# Altium schematic sheet THIETBINHIEPTIM.SchDoc
size 431 x 279 mm; SheetNumber: 1; SheetTotal: 1
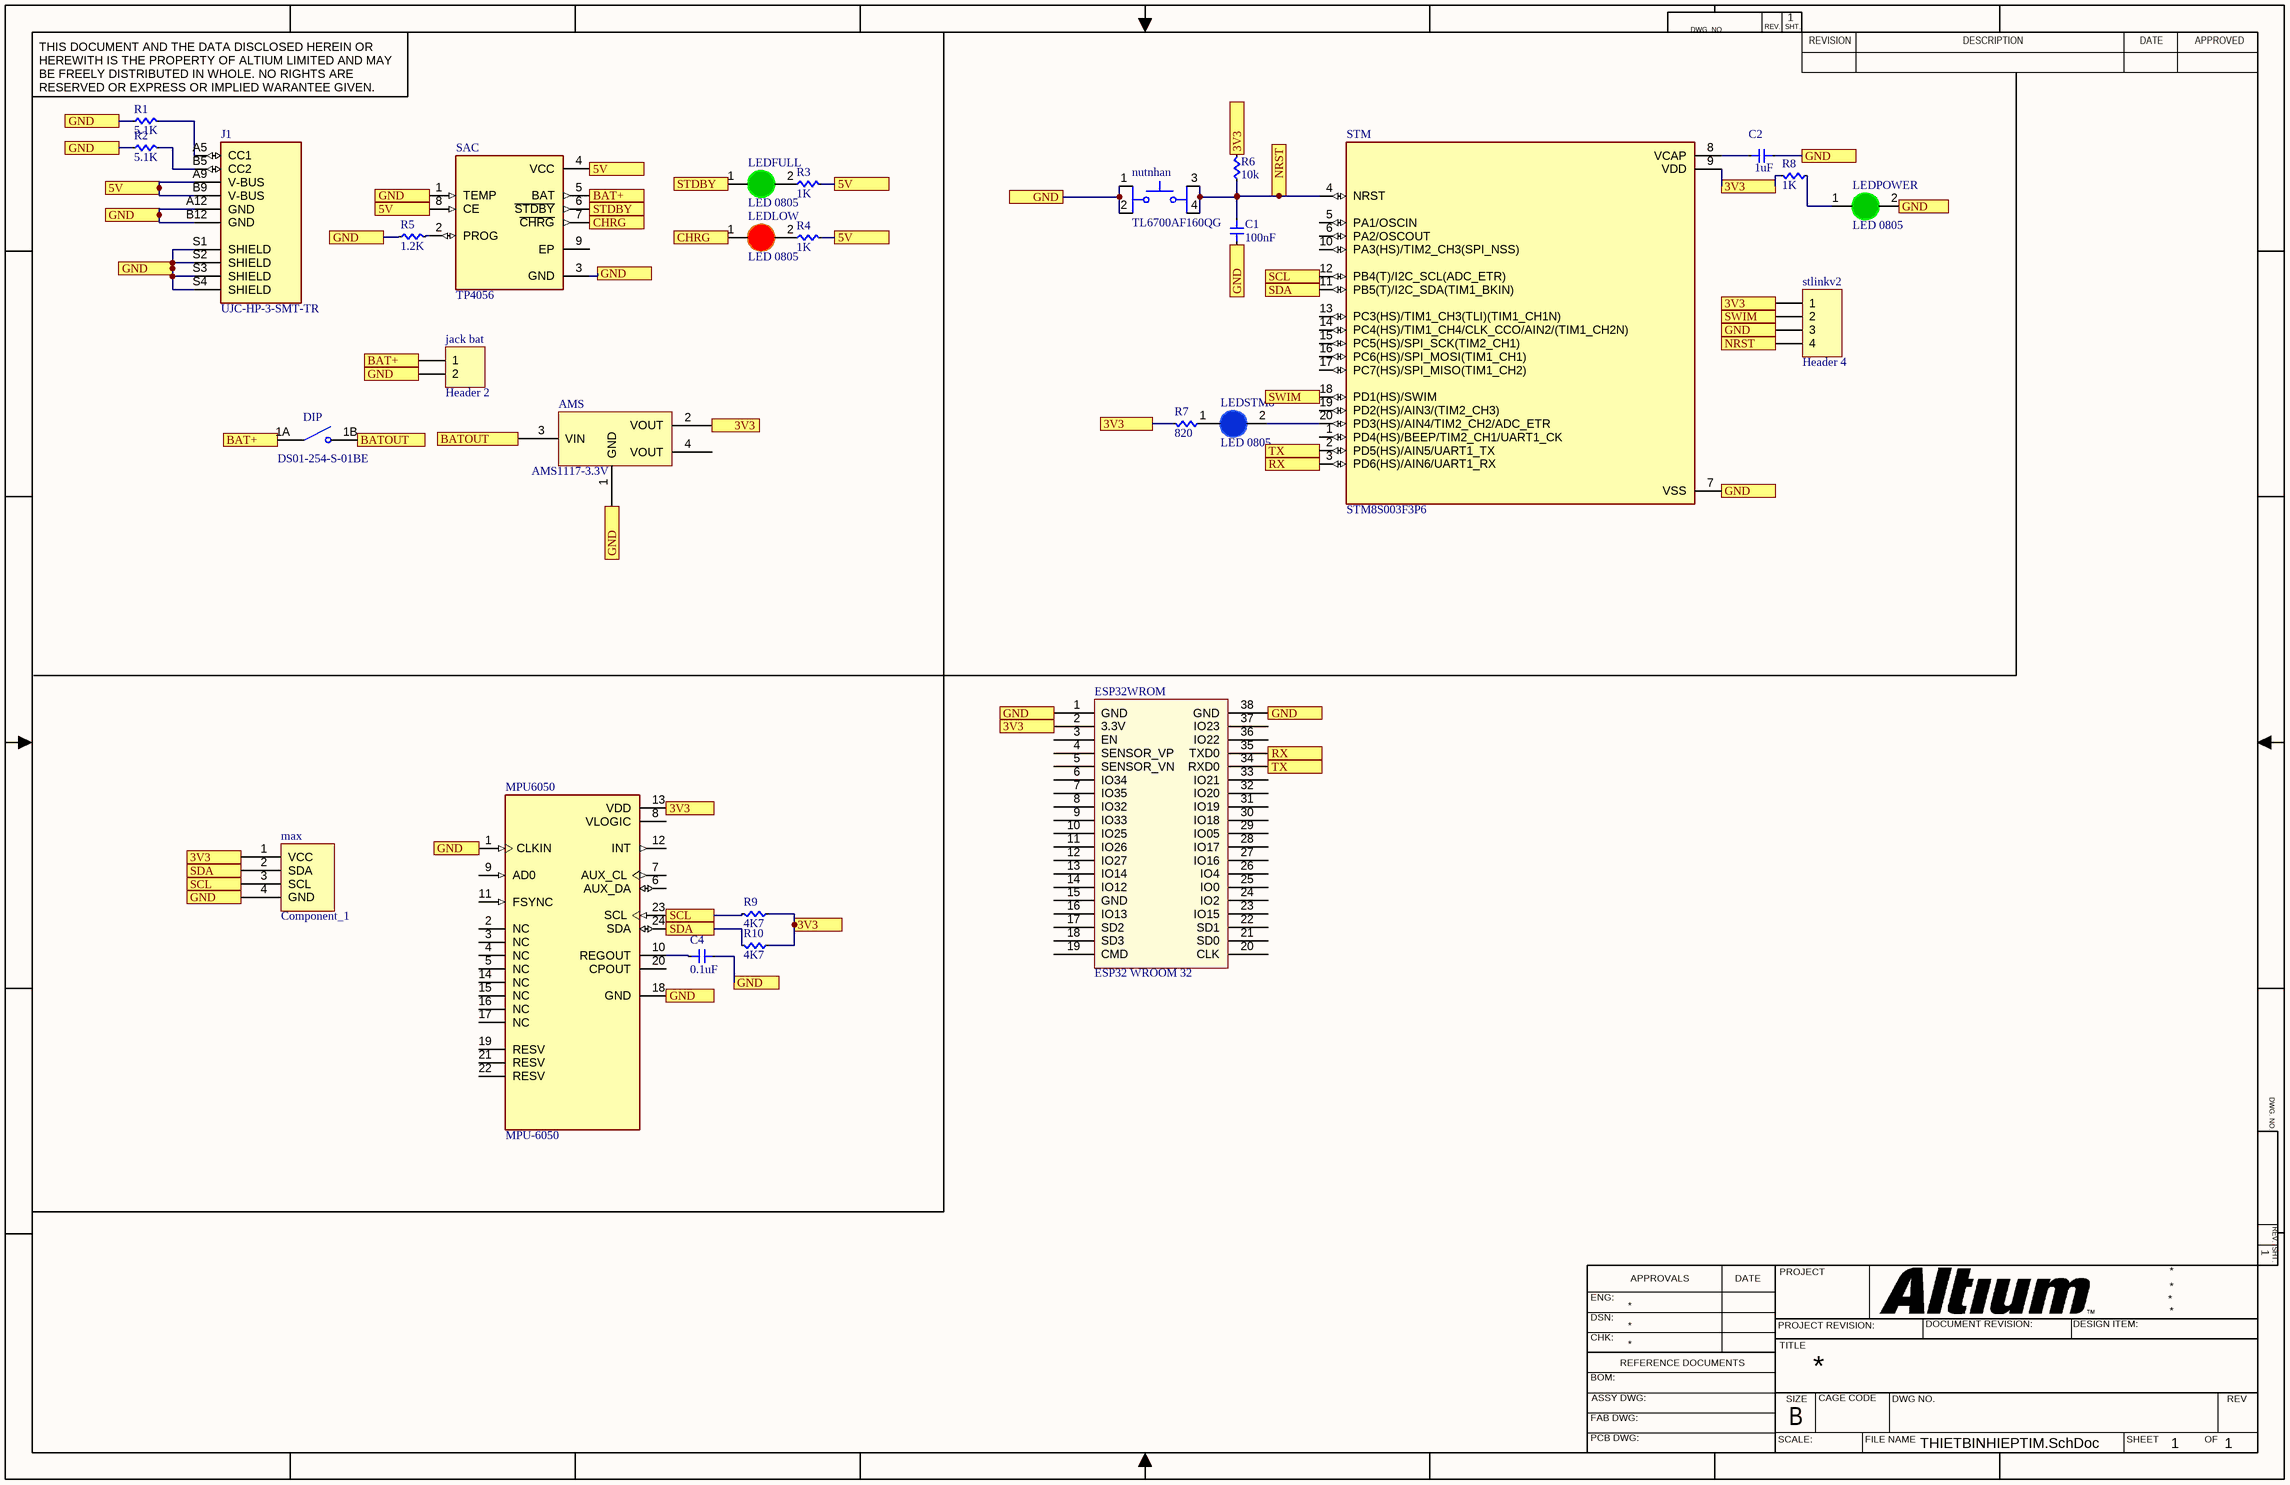
[diagram p0: THIETBINHIEPTIM.SchDoc]

## Parts
AMS  AMS1117-3.3V  [SOT223]
C1  100nF  [Cap 0201]
C2  1uF  [Cap 0201]
C4  0.1uF  [Cap 0201]
DIP  DS01-254-S-01BE  [SW_DS01-254-S-01BE]
ESP32WROM  ESP32 WROOM 32  [ESP32-WROOM-32D]
J1  UJC-HP-3-SMT-TR  [CUI_UJC-HP-3-SMT-TR]
jack_bat  Header 2  [HDR1X2]
LEDFULL  LED 0805  [LED-0805-Green]
LEDLOW  LED 0805  [LED-0805-Red]
LEDPOWER  LED 0805  [LED-0805-Green]
LEDSTM8  LED 0805  [LED-0805-Blue]
max  Component_1  [PCBComponent_1]
MPU6050  MPU-6050  [QFN50P400X400X95-24N]
nutnhan  TL6700AF160QG  [SW_TL6700AF160QG]
R1  5.1K  [RES 0402]
R2  5.1K  [RES 0402]
R3  1K  [RES 0402]
R4  1K  [RES 0402]
R5  1.2K  [RES 0402]
R6  10k  [RES 0402]
R7  820  [RES 0402]
R8  1K  [RES 0402]
R9  4K7  [RES 0402]
R10  4K7  [RES 0402]
SAC  TP4056  [SOP127P600X175-9N]
stlinkv2  Header 4  [HDR1X4]
STM  STM8S003F3P6  [SOP65P640X120-20N]

## Ports
3V3, 5V, BAT+, BATOUT, CHRG, GND, NRST, RX, SCL, SDA, STDBY, SWIM, TX

## Nets
3V3: AMS.2(VOUT) ESP32WROM.2(3.3V) max.1(VCC) MPU6050.13(VDD) R6.2 R7.2 R8.2 R9.1 R10.1 stlinkv2.1 STM.9(VDD) ; port 3V3
5V: J1.A9(V-BUS) J1.B9(V-BUS) R3.2 R4.2 SAC.4(VCC) SAC.8(CE) ; port 5V
BAT+: DIP.1A(COM1) jack_bat.1 SAC.5(BAT) ; port BAT+
BATOUT: AMS.3(VIN) DIP.1B(NO1) ; port BATOUT
CHRG: LEDLOW.1(A) SAC.7(~{CHRG}) ; port CHRG
GND: AMS.1(GND) C1.2 C2.1 C4.2 ESP32WROM.1(GND) ESP32WROM.38(GND) J1.A12(GND) J1.B12(GND) J1.S1(SHIELD) J1.S2(SHIELD) J1.S3(SHIELD) J1.S4(SHIELD) jack_bat.2 LEDPOWER.2(K) max.4(GND) MPU6050.1(CLKIN) MPU6050.18(GND) nutnhan.1 nutnhan.2 R1.1 R2.1 R5.1 SAC.1(TEMP) SAC.3(GND) stlinkv2.3 STM.7(VSS) ; port GND
NRST: C1.1 nutnhan.3 nutnhan.4 R6.1 stlinkv2.4 STM.4(NRST) ; port NRST
RX: ESP32WROM.35(TXD0) STM.3(PD6(HS)/AIN6/UART1_RX) ; port RX
SCL: max.3(SCL) MPU6050.23(SCL) R9.2 STM.12(PB4(T)/I2C_SCL(ADC_ETR)) ; port SCL
SDA: max.2(SDA) MPU6050.24(SDA) R10.2 STM.11(PB5(T)/I2C_SDA(TIM1_BKIN)) ; port SDA
STDBY: LEDFULL.1(A) SAC.6(~{STDBY}) ; port STDBY
SWIM: stlinkv2.2 STM.18(PD1(HS)/SWIM) ; port SWIM
TX: ESP32WROM.34(RXD0) STM.2(PD5(HS)/AIN5/UART1_TX) ; port TX
NetC2_2: C2.2 STM.8(VCAP)
NetC4_1: C4.1 MPU6050.10(REGOUT)
NetJ1_A5: J1.A5(CC1) R1.2
NetJ1_B5: J1.B5(CC2) R2.2
NetLEDFULL_2: LEDFULL.2(K) R3.1
NetLEDLOW_2: LEDLOW.2(K) R4.1
NetLEDPOWER_1: LEDPOWER.1(A) R8.1
NetLEDSTM8_1: LEDSTM8.1(A) R7.1
NetLEDSTM8_2: LEDSTM8.2(K) STM.20(PD3(HS)/AIN4/TIM2_CH2/ADC_ETR)
NetR5_2: R5.2 SAC.2(PROG)

Not connected (* = marked no-connect by the designer): AMS 4(VOUT); ESP32WROM 3(EN) 4(SENSOR_VP) 5(SENSOR_VN) 6(IO34) 7(IO35) 8(IO32) 9(IO33) 10(IO25) 11(IO26) 12(IO27) 13(IO14) 14(IO12) 15(GND) 16(IO13) 17(SD2) 18(SD3) 19(CMD) 20(CLK) 21(SD0) 22(SD1) 23(IO15) 24(IO2) 25(IO0) 26(IO4) 27(IO16) 28(IO17) 29(IO05) 30(IO18) 31(IO19) 32(IO20) 33(IO21) 36(IO22) 37(IO23); MPU6050 2(NC) 3(NC) 4(NC) 5(NC) 6(AUX_DA) 7(AUX_CL) 8(VLOGIC) 9(AD0) 11(FSYNC) 12(INT) 14(NC) 15(NC) 16(NC) 17(NC) 19(RESV) 20(CPOUT) 21(RESV) 22(RESV); SAC 9(EP); STM 1(PD4(HS)/BEEP/TIM2_CH1/UART1_CK) 5(PA1/OSCIN) 6(PA2/OSCOUT) 10(PA3(HS)/TIM2_CH3(SPI_NSS)) 13(PC3(HS)/TIM1_CH3(TLI)(TIM1_CH1N)) 14(PC4(HS)/TIM1_CH4/CLK_CCO/AIN2/(TIM1_CH2N)) 15(PC5(HS)/SPI_SCK(TIM2_CH1)) 16(PC6(HS)/SPI_MOSI(TIM1_CH1)) 17(PC7(HS)/SPI_MISO(TIM1_CH2)) 19(PD2(HS)/AIN3/(TIM2_CH3))

## Notes on the sheet
- DWG. NO.
- REV.
- SHT.
- THIS DOCUMENT AND THE DATA DISCLOSED HEREIN OR HEREWITH IS THE PROPERTY OF ALTIUM LIMITED AND MAY BE FREELY DISTRIBUTED IN WHOLE. NO RIGHTS ARE RESERVED OR EXPRESS OR IMPLIED WARANTEE GIVEN.
- REVISION
- DESCRIPTION
- DATE
- APPROVED
- ENG:
- APPROVALS
- PROJECT
- DSN:
- CHK:
- REFERENCE DOCUMENTS
- PROJECT REVISION:
- TITLE
- DOCUMENT REVISION:
- DESIGN ITEM:
- BOM:
- FAB DWG:
- PCB DWG:
- ASSY DWG:
- SCALE:
- SIZE
- B
- CAGE CODE
- FILE NAME
- DWG NO.
- SHEET
- OF
- REV

## Library data of the parts
AMS = AMS1117 SMD: Dán; Value: AMS1117-3.3V SOT223; Don_Vi: Con; Ma_Hang: MH000596; Ghi_Chu: *; Kieu_Chan: *; Chung_Loai: Dán
C1 C2 C4 = Cap 0201: Capacitor SMD 0201
DIP = DS01-254-S-01BE: 1 Position, Through Hole, 2.54 mm Pitch, Raised Slide Actuator, Flat Bottom, Short Pin, DIP Switch; MF: Same Sky; SnapEDA_Link: https://www.snapeda.com/parts/DS01-254-S-01BE/Same+Sky/view-part/?ref=snap; Package: None; Value: *; MP: DS01-254-S-01BE; Check_prices: https://www.snapeda.com/parts/DS01-254-S-01BE/Same+Sky/view-part/?ref=eda
jack_bat = Header 2: Header, 2-Pin; LatestRevisionDate: 17-Jul-2002; LatestRevisionNote: Re-released for DXP Platform.; Publisher: Altium Limited
LEDFULL LEDPOWER = LED 0805 Xanh La: Dán; Don_Vi: Con; Ma_Hang: MH002326; Ten_Linh_Kien: LED 0805 Màu Xanh Lá (Green); Ghi_Chu: *; Kieu_Chan: *; Chung_Loai: Dán
LEDLOW = LED 0805 Do: Dán; Don_Vi: Con; Ma_Hang: MH000897; Ten_Linh_Kien: LED 0805 Màu Đỏ (Red); Ghi_Chu: *; Kieu_Chan: *; Chung_Loai: Dán
LEDSTM8 = LED 0805 Xanh Duong: Dán; Don_Vi: Con; Ma_Hang: MH002327; Ten_Linh_Kien: LED 0805 Màu Xanh Dương (Blue); Ghi_Chu: *; Kieu_Chan: *; Chung_Loai: Dán
MPU6050 = MPU-6050: MPU-6050 series Accelerometer, Gyroscope, 3 Axis Sensor Evaluation Board; MF: TDK InvenSense; SnapEDA_Link: https://www.snapeda.com/parts/MPU-6050/TDK+InvenSense/view-part/?ref=snap; Package: QFN-24 InvenSense; Value: *; MP: MPU-6050; Check_prices: https://www.snapeda.com/parts/MPU-6050/TDK+InvenSense/view-part/?ref=eda
R1-R5 R7-R10 = RES 0402: RES SMD 0402; Manufacturer: Vishay Dale; Manufacturer Part Number: CRCW040210K0FKED; Resistance (Ohms): 10k; Tolerance: ±1%; Power (Watts): 0.063W, 1/16W; Temperature Coefficient: ±100ppm/°C; Supplier 1: Digi-Key; RoHS: RoHS Compliant; Category: Resistors; Stock 1: 2392462; Pricing 1: 10=0.083, 50=0.0444, 200=0.0255, 1000=0.0174 (USD); Packaging: Cut Tape (CT); Composition: Thick Film; Features: Automotive AEC-Q200; Operating Temperature: -55°C ~ 155°C; Package / Case: 0402 (1005 Metric); Supplier Device Package: 0402 (1005 Metric); Size / Dimension: 0.039" L x 0.020" W (1.00mm x 0.50mm); Height: 0.016" (0.40mm); Number of Terminations: 2; ComponentLink1URL: http://www.vishay.com/docs/20035/dcrcwe3.pdf; ComponentLink1Description: http://www.vishay.com/docs/20035/dcrcwe3.pdf; Supplier Part Number 1: 541-10.0KLCT-ND
R6 = RES 0402: RES SMD 0402; Manufacturer: Vishay Dale; Manufacturer Part Number: CRCW040210K0FKED; Tolerance: ±1%; Power (Watts): 0.063W, 1/16W; Temperature Coefficient: ±100ppm/°C; Supplier 1: Digi-Key; RoHS: RoHS Compliant; Category: Resistors; Stock 1: 2392462; Pricing 1: 10=0.083, 50=0.0444, 200=0.0255, 1000=0.0174 (USD); Packaging: Cut Tape (CT); Resistance (Ohms): 10k; Composition: Thick Film; Features: Automotive AEC-Q200; Operating Temperature: -55°C ~ 155°C; Package / Case: 0402 (1005 Metric); Supplier Device Package: 0402 (1005 Metric); Size / Dimension: 0.039" L x 0.020" W (1.00mm x 0.50mm); Height: 0.016" (0.40mm); Number of Terminations: 2; ComponentLink1URL: http://www.vishay.com/docs/20035/dcrcwe3.pdf; ComponentLink1Description: http://www.vishay.com/docs/20035/dcrcwe3.pdf; Supplier Part Number 1: 541-10.0KLCT-ND
SAC = TP4056: Complete single cell Li-Ion battery with a constant current / constant voltage linear charger; MF: NanJing Top Power ASIC Corp.; Check_prices: https://www.snapeda.com/parts/TP4056/NanJing+Top+Power+ASIC+Corp./view-part/?ref=eda; SnapEDA_Link: https://www.snapeda.com/parts/TP4056/NanJing+Top+Power+ASIC+Corp./view-part/?ref=snap; Price: None; Availability: Not in stock; Package: Package; MP: TP4056; Value: *
stlinkv2 = Header 4: Header, 4-Pin; LatestRevisionDate: 17-Jul-2002; LatestRevisionNote: Re-released for DXP Platform.; Publisher: Altium Limited
STM = STM8S003F3P6: STM8 series Microcontroller IC 8-Bit 16MHz 8KB (8K x 8) FLASH 20-TSSOP; MF: STMicroelectronics; SnapEDA_Link: https://www.snapeda.com/parts/STM8S003F3P6/STMicroelectronics/view-part/?ref=snap; Package: TSSOP-20 STMicroelectronics; Value: *; MP: STM8S003F3P6; Check_prices: https://www.snapeda.com/parts/STM8S003F3P6/STMicroelectronics/view-part/?ref=eda
J1 = UJC-HP-3-SMT-TR: Package: None; Price: None; Value: *; MP: UJC-HP-3-SMT-TR; Availability: Unavailable
nutnhan = TL6700AF160QG: Value: *; Package: None; Price: None; MP: TL6700AF160QG; Availability: Unavailable